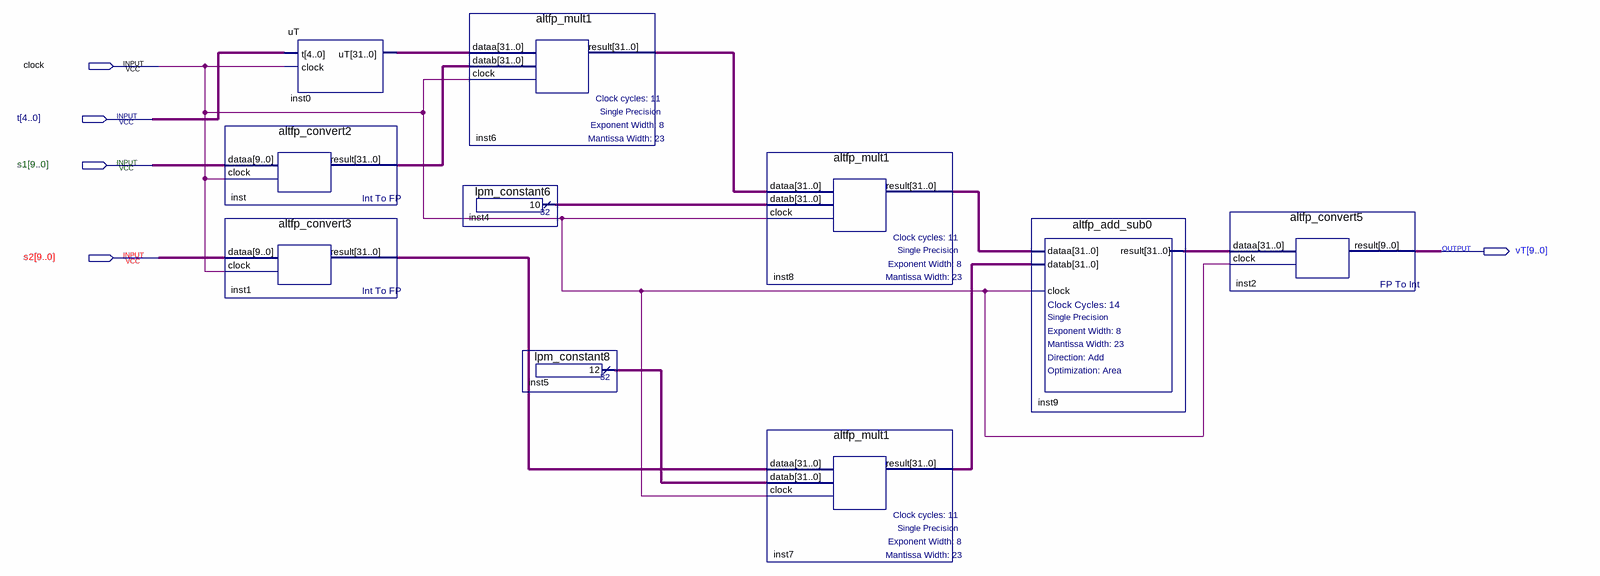
[diagram p0: schematic sheet]
// Quartus schematic vT.bdf as structural Verilog: 10 symbols, 5 pins
module vT (
  input  clock,
  input  [4:0] t,
  input  [9:0] s1,
  input  [9:0] s2,
  output [9:0] vT
);

  wire [31:0] inst0_ut, inst1_result, inst4_result, inst5_result, inst6_result, inst7_result, inst8_result,
       inst9_result, inst_result;

  altfp_convert2 inst (.dataa(s1), .clock(clock), .result(inst_result));
  altfp_convert3 inst1 (.dataa(s2), .clock(clock), .result(inst1_result));
  uT inst0 (.t(t), .clock(clock), .uT(inst0_ut));
  altfp_mult1 inst6 (.dataa(inst0_ut), .datab(inst_result), .clock(clock), .result(inst6_result));
  lpm_constant6 inst4 (.result(inst4_result));
  lpm_constant8 inst5 (.result(inst5_result));
  altfp_mult1 inst8 (.dataa(inst6_result), .datab(inst4_result), .clock(clock), .result(inst8_result));
  altfp_mult1 inst7 (.dataa(inst1_result), .datab(inst5_result), .clock(clock), .result(inst7_result));
  altfp_add_sub0 inst9 (.dataa(inst8_result), .datab(inst7_result), .clock(clock), .result(inst9_result));
  altfp_convert5 inst2 (.dataa(inst9_result), .clock(clock), .result(vT));
endmodule
